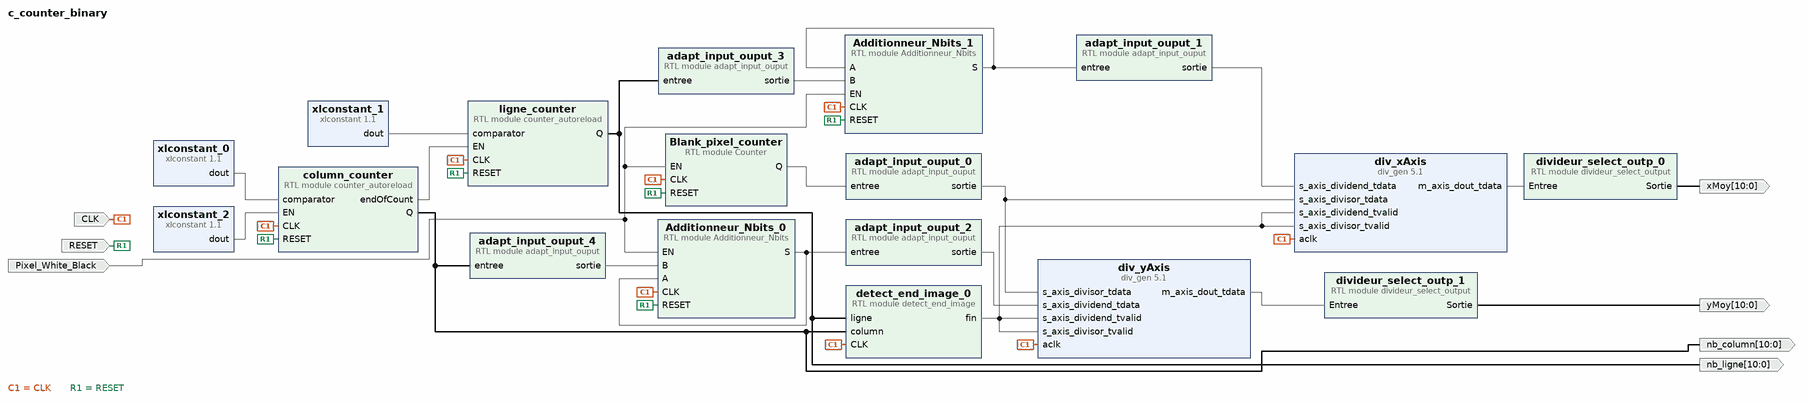
[diagram p0: block diagram of the top level]
# Vivado block design c_counter_binary, xc7z020clg400-1, Vivado 2018.2.1
create_bd_design c_counter_binary

create_bd_port -dir I -type clk CLK
create_bd_port -dir I Pixel_White_Black
create_bd_port -dir I -type rst RESET
create_bd_port -dir O -from 10 -to 0 nb_ligne
create_bd_port -dir O -from 10 -to 0 nb_column
create_bd_port -dir O -from 10 -to 0 xMoy
create_bd_port -dir O -from 10 -to 0 yMoy

create_bd_cell -type ip -vlnv xilinx.com:ip:div_gen:5.1 div_xAxis
set_property -dict [list \
  CONFIG.algorithm_type Radix2 \
  CONFIG.dividend_and_quotient_width 18 \
  CONFIG.dividend_has_tuser false \
  CONFIG.dividend_has_tlast false \
  CONFIG.divisor_width 11 \
  CONFIG.remainder_type Remainder \
  CONFIG.fractional_width 11 \
  CONFIG.operand_sign Unsigned \
  CONFIG.clocks_per_division 1 \
  CONFIG.divide_by_zero_detect false \
  CONFIG.OutTLASTBehv Null \
  CONFIG.latency 20 \
  CONFIG.ACLKEN false \
] [get_bd_cells div_xAxis]
create_bd_cell -type ip -vlnv xilinx.com:ip:div_gen:5.1 div_yAxis
set_property -dict [list \
  CONFIG.algorithm_type Radix2 \
  CONFIG.dividend_and_quotient_width 18 \
  CONFIG.dividend_has_tuser false \
  CONFIG.dividend_has_tlast false \
  CONFIG.divisor_width 11 \
  CONFIG.remainder_type Remainder \
  CONFIG.fractional_width 11 \
  CONFIG.operand_sign Unsigned \
  CONFIG.clocks_per_division 1 \
  CONFIG.divide_by_zero_detect false \
  CONFIG.OutTLASTBehv Null \
  CONFIG.latency 20 \
  CONFIG.ACLKEN false \
] [get_bd_cells div_yAxis]
create_bd_cell -type module -reference adapt_input_ouput adapt_input_ouput_0
set_property -dict {CONFIG.N 11 CONFIG.M 16} [get_bd_cells adapt_input_ouput_0]
create_bd_cell -type module -reference adapt_input_ouput adapt_input_ouput_1
set_property -dict {CONFIG.N 18 CONFIG.M 24} [get_bd_cells adapt_input_ouput_1]
create_bd_cell -type module -reference adapt_input_ouput adapt_input_ouput_2
set_property -dict {CONFIG.N 18 CONFIG.M 24} [get_bd_cells adapt_input_ouput_2]
create_bd_cell -type module -reference Counter Blank_pixel_counter
set_property -dict {CONFIG.N 11} [get_bd_cells Blank_pixel_counter]
create_bd_cell -type module -reference adapt_input_ouput adapt_input_ouput_3
set_property -dict {CONFIG.N 11 CONFIG.M 18} [get_bd_cells adapt_input_ouput_3]
create_bd_cell -type module -reference adapt_input_ouput adapt_input_ouput_4
set_property -dict {CONFIG.N 11 CONFIG.M 18} [get_bd_cells adapt_input_ouput_4]
create_bd_cell -type module -reference Additionneur_Nbits Additionneur_Nbits_0
set_property -dict {CONFIG.N 18} [get_bd_cells Additionneur_Nbits_0]
create_bd_cell -type module -reference Additionneur_Nbits Additionneur_Nbits_1
set_property -dict {CONFIG.N 18} [get_bd_cells Additionneur_Nbits_1]
create_bd_cell -type ip -vlnv xilinx.com:ip:xlconstant:1.1 xlconstant_0
set_property -dict {CONFIG.CONST_WIDTH 11 CONFIG.CONST_VAL 1599} [get_bd_cells xlconstant_0]
create_bd_cell -type ip -vlnv xilinx.com:ip:xlconstant:1.1 xlconstant_1
set_property -dict {CONFIG.CONST_WIDTH 11 CONFIG.CONST_VAL 1199} [get_bd_cells xlconstant_1]
create_bd_cell -type ip -vlnv xilinx.com:ip:xlconstant:1.1 xlconstant_2
set_property -dict {CONFIG.CONST_WIDTH 1 CONFIG.CONST_VAL 1} [get_bd_cells xlconstant_2]
create_bd_cell -type module -reference counter_autoreload ligne_counter
set_property -dict {CONFIG.N 11} [get_bd_cells ligne_counter]
create_bd_cell -type module -reference counter_autoreload column_counter
set_property -dict {CONFIG.N 11} [get_bd_cells column_counter]
create_bd_cell -type module -reference detect_end_image detect_end_image_0
create_bd_cell -type module -reference divideur_select_output divideur_select_outp_0
create_bd_cell -type module -reference divideur_select_output divideur_select_outp_1

# ---- connections ----

connect_bd_net [get_bd_ports CLK] \
  [get_bd_pins div_xAxis/aclk] [get_bd_pins div_yAxis/aclk] [get_bd_pins Blank_pixel_counter/CLK] \
  [get_bd_pins Additionneur_Nbits_0/CLK] [get_bd_pins Additionneur_Nbits_1/CLK] [get_bd_pins ligne_counter/CLK] \
  [get_bd_pins column_counter/CLK] [get_bd_pins detect_end_image_0/CLK]
connect_bd_net [get_bd_pins detect_end_image_0/fin] \
  [get_bd_pins div_xAxis/s_axis_divisor_tvalid] [get_bd_pins div_xAxis/s_axis_dividend_tvalid] \
  [get_bd_pins div_yAxis/s_axis_divisor_tvalid] [get_bd_pins div_yAxis/s_axis_dividend_tvalid]
connect_bd_net [get_bd_ports Pixel_White_Black] \
  [get_bd_pins Blank_pixel_counter/EN] [get_bd_pins Additionneur_Nbits_1/EN] [get_bd_pins Additionneur_Nbits_0/EN]
connect_bd_net -net RESET_counter_ligne_and_column_1 [get_bd_ports RESET] \
  [get_bd_pins Blank_pixel_counter/RESET] [get_bd_pins Additionneur_Nbits_0/RESET] [get_bd_pins Additionneur_Nbits_1/RESET] \
  [get_bd_pins ligne_counter/RESET] [get_bd_pins column_counter/RESET]
connect_bd_net [get_bd_pins div_xAxis/m_axis_dout_tdata] [get_bd_pins divideur_select_outp_0/Entree]
connect_bd_net [get_bd_pins div_yAxis/m_axis_dout_tdata] [get_bd_pins divideur_select_outp_1/Entree]
connect_bd_net [get_bd_pins adapt_input_ouput_0/sortie] [get_bd_pins div_xAxis/s_axis_divisor_tdata] [get_bd_pins div_yAxis/s_axis_divisor_tdata]
connect_bd_net [get_bd_pins adapt_input_ouput_2/sortie] [get_bd_pins div_yAxis/s_axis_dividend_tdata]
connect_bd_net [get_bd_pins adapt_input_ouput_1/sortie] [get_bd_pins div_xAxis/s_axis_dividend_tdata]
connect_bd_net -net ligne_counter2_Q [get_bd_pins Blank_pixel_counter/Q] [get_bd_pins adapt_input_ouput_0/entree]
connect_bd_net [get_bd_pins ligne_counter/Q] [get_bd_ports nb_ligne] [get_bd_pins adapt_input_ouput_3/entree] [get_bd_pins detect_end_image_0/ligne]
connect_bd_net [get_bd_pins column_counter/Q] \
  [get_bd_ports nb_column] [get_bd_pins adapt_input_ouput_4/entree] [get_bd_pins detect_end_image_0/column]
connect_bd_net [get_bd_pins Additionneur_Nbits_0/S] [get_bd_pins adapt_input_ouput_2/entree] [get_bd_pins Additionneur_Nbits_0/A]
connect_bd_net [get_bd_pins adapt_input_ouput_4/sortie] [get_bd_pins Additionneur_Nbits_0/B]
connect_bd_net [get_bd_pins adapt_input_ouput_3/sortie] [get_bd_pins Additionneur_Nbits_1/B]
connect_bd_net [get_bd_pins Additionneur_Nbits_1/S] [get_bd_pins adapt_input_ouput_1/entree] [get_bd_pins Additionneur_Nbits_1/A]
connect_bd_net [get_bd_pins xlconstant_0/dout] [get_bd_pins column_counter/comparator]
connect_bd_net [get_bd_pins xlconstant_1/dout] [get_bd_pins ligne_counter/comparator]
connect_bd_net [get_bd_pins xlconstant_2/dout] [get_bd_pins column_counter/EN]
connect_bd_net [get_bd_pins column_counter/endOfCount] [get_bd_pins ligne_counter/EN]
connect_bd_net [get_bd_pins divideur_select_outp_1/Sortie] [get_bd_ports yMoy]
connect_bd_net [get_bd_pins divideur_select_outp_0/Sortie] [get_bd_ports xMoy]

validate_bd_design
save_bd_design
